# EAGLE schematic 5hp proto (EAGLE 9.2.2)
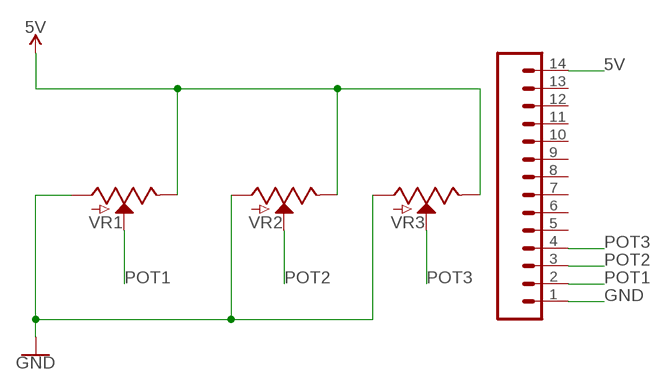
[diagram p0: schematic, sheet 1]

## Parts
J2  CONN_14SQUARE  [1X14]
VR1  POTENTIOMETERPOTV  [POT_V]
VR2  POTENTIOMETERPOTV  [POT_V]
VR3  POTENTIOMETERPOTV  [POT_V]

## Nets
5V: J2.14 VR1.P3(E) VR2.P3(E) VR3.P3(E)
GND: J2.1 VR1.P1(A) VR2.P1(A) VR3.P1(A)
POT1: J2.2 VR1.P2(S)
POT2: J2.3 VR2.P2(S)
POT3: J2.4 VR3.P2(S)
Unconnected: J2.5 J2.6 J2.7 J2.8 J2.9 J2.10 J2.11 J2.12 J2.13

## Library data of the parts
J2 = CFO:CONN_14: Multi connection point. Often used as Generic Header-pin footprint for 0.1 inch spaced/style header connections On any of the 0.1 inch spaced packages, you can populate with these: Break Away Headers - Straight <https://www.sparkfun.com/products/116> (PRT-00116) Break Away Male Headers - Right Angle <https://www.sparkfun.com/products/553> (PRT-00553) Female Headers <https://www.sparkfun.com/products/115> (PRT-00115) Break Away Headers - Machine Pin <https://www.sparkfun.com/products/117> (PRT-00117) Break Away Female Headers - Swiss Machine Pin <https://www.sparkfun.com/products/743> (PRT-00743) For SCREWTERMINALS and SPRING TERMINALS visit here: Screw Terimnals on SparkFun.com <https://www.sparkfun.com/search/results?term=Screw+Terminals> (5mm/3.5mm/2.54mm spacing) This device is also useful as a general connection point to wire up your design to another part of your project. Our various solder wires solder well into these plated through hole pads. Hook-Up Wire - Assortment (Stranded, 22 AWG) <https://www.sparkfun.com/products/11375> (PRT-11375) Hook-Up Wire - Assortment (Solid Core, 22 AWG) <https://www.sparkfun.com/products/11367> (PRT-11367) View the entire wire category on our website here <https://www.sparkfun.com/categories/141> Special notes: Molex polarized connector foot print use with SKU : PRT-08231 with associated crimp pins and housings. 1MM SMD Version SKU: PRT-10208 NOTES ON THE VARIANTS LOCK and LOCK_LONGPADS... This footprint was designed to help hold the alignment of a through-hole component (i.e. 6-pin header) while soldering it into place. You may notice that each hole has been shifted either up or down by 0.005 of an inch from it's more standard position (which is a perfectly straight line). This slight alteration caused the pins (the squares in the middle) to touch the edges of the holes. Because they are alternating, it causes a "brace" to hold the component in place. 0.005 has proven to be the perfect amount of "off-center" position when using our standard breakaway headers. Although looks a little odd when you look at the bare footprint, once you have a header in there, the alteration is very hard to notice. Also,if you push a header all the way into place, it is covered up entirely on the bottom side.
VR1-VR3 = CFO:POTENTIOMETER: CFO potentiometer Three-terminal potentiometers, with an adjustable wiper and two adjustable resistors. A pot can be used to create a configurable voltage divider, or as a variable resistor. supply mouser link Rotary Potentiometer - Linear (20k ohm) <https://www.mouser.dk/ProductDetail/BI-Technologies-TT-Electronics/P120PK-Y20BR20K?qs=sGAEpiMZZMtC25l1F4XBUzVC3q8S9Qb82X3d3LG%2fQu4%3d> mouser part no: 858-P120PK-Y20BR20K